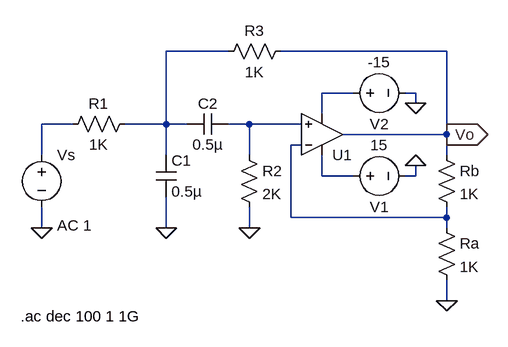
[diagram p0: schematic Run_3.asc]
Run_3.asc, the LTspice schematic file:
Version 4
SHEET 1 1092 680
WIRE 256 64 160 64
WIRE 592 64 336 64
WIRE 448 128 400 128
WIRE 544 128 528 128
WIRE 544 144 544 128
WIRE 400 160 400 128
WIRE 16 176 -32 176
WIRE 160 176 160 64
WIRE 160 176 96 176
WIRE 192 176 160 176
WIRE 288 176 256 176
WIRE 368 176 288 176
WIRE 592 192 592 64
WIRE 592 192 432 192
WIRE 368 208 352 208
WIRE -32 224 -32 176
WIRE 160 224 160 176
WIRE 288 224 288 176
WIRE 592 224 592 192
WIRE 400 256 400 224
WIRE 448 256 400 256
WIRE 544 256 544 240
WIRE 544 256 528 256
WIRE 352 320 352 208
WIRE 592 320 592 304
WIRE 592 320 352 320
WIRE -32 336 -32 304
WIRE 160 336 160 288
WIRE 288 336 288 304
WIRE 592 336 592 320
WIRE 592 448 592 416
FLAG 544 240 0
FLAG 544 144 0
FLAG 592 192 Vo
IOPIN 592 192 Out
FLAG -32 336 0
FLAG 160 336 0
FLAG 288 336 0
FLAG 592 448 0
SYMBOL voltage -32 208 R0
WINDOW 123 24 124 Left 2
WINDOW 39 0 0 Left 0
SYMATTR Value2 AC 1
SYMATTR InstName Vs
SYMATTR Value ""
SYMBOL res 112 160 R90
WINDOW 0 0 56 VBottom 2
WINDOW 3 32 56 VTop 2
SYMATTR InstName R1
SYMATTR Value 1K
SYMBOL cap 144 224 R0
SYMATTR InstName C1
SYMATTR Value 0.5µ
SYMBOL cap 256 160 R90
WINDOW 0 0 32 VBottom 2
WINDOW 3 32 32 VTop 2
SYMATTR InstName C2
SYMATTR Value 0.5µ
SYMBOL res 272 208 R0
SYMATTR InstName R2
SYMATTR Value 2K
SYMBOL OpAmps\\UniversalOpamp2 400 192 M180
SYMATTR InstName U1
SYMBOL voltage 432 256 M90
WINDOW 0 32 56 VTop 2
WINDOW 3 -32 56 VBottom 2
WINDOW 123 0 0 Left 0
WINDOW 39 0 0 Left 0
SYMATTR InstName V1
SYMATTR Value 15
SYMBOL voltage 432 128 M90
WINDOW 0 32 56 VTop 2
WINDOW 3 -32 56 VBottom 2
WINDOW 123 0 0 Left 0
WINDOW 39 0 0 Left 0
SYMATTR InstName V2
SYMATTR Value -15
SYMBOL res 352 48 R90
WINDOW 0 0 56 VBottom 2
WINDOW 3 32 56 VTop 2
SYMATTR InstName R3
SYMATTR Value 1K
SYMBOL res 576 208 R0
SYMATTR InstName Rb
SYMATTR Value 1K
SYMBOL res 576 320 R0
SYMATTR InstName Ra
SYMATTR Value 1K
TEXT -64 472 Left 2 !.ac dec 100 1 1G

The netlist it stands for:
* Run_3.asc
Vs N003 0 AC 1
R1 N001 N003 1K
C1 N001 0 0.5µ
C2 N004 N001 0.5µ
R2 N004 0 2K
XU1 N004 N005 N006 N002 Vo level.2 Avol=1Meg GBW=10Meg Slew=10Meg ilimit=25m rail=0 Vos=0 phimargin=45 en=0 enk=0 in=0 ink=0 Rin=500Meg  ; pins IN+ IN- V+ V- OUT
V1 N006 0 15
V2 N002 0 -15
R3 Vo N001 1K
Rb Vo N005 1K
Ra N005 0 1K
.ac dec 100 1 1G
.lib UniversalOpamps2.sub
.backanno
.end